# Altium schematic sheet PowerManagement_Base.SchDoc: Power Management Base
size A3; DrawnBy: Fabian Niederberger; Engineer: Fabian Niederberger; Organization: HSLU T&A; Address1: Abteilung Elektrotechnik; Address2: Technikumsstrasse 21; Address3: CH-6048 Horw; DocumentNumber: 1; Revision: 1.0; SheetNumber: 1; SheetTotal: 3; Projektname: PREN2 Team10; pcbDesigner: Fabian Niederberger; DocumentName: Power Managment Base; ProjectName: Power Managment Base
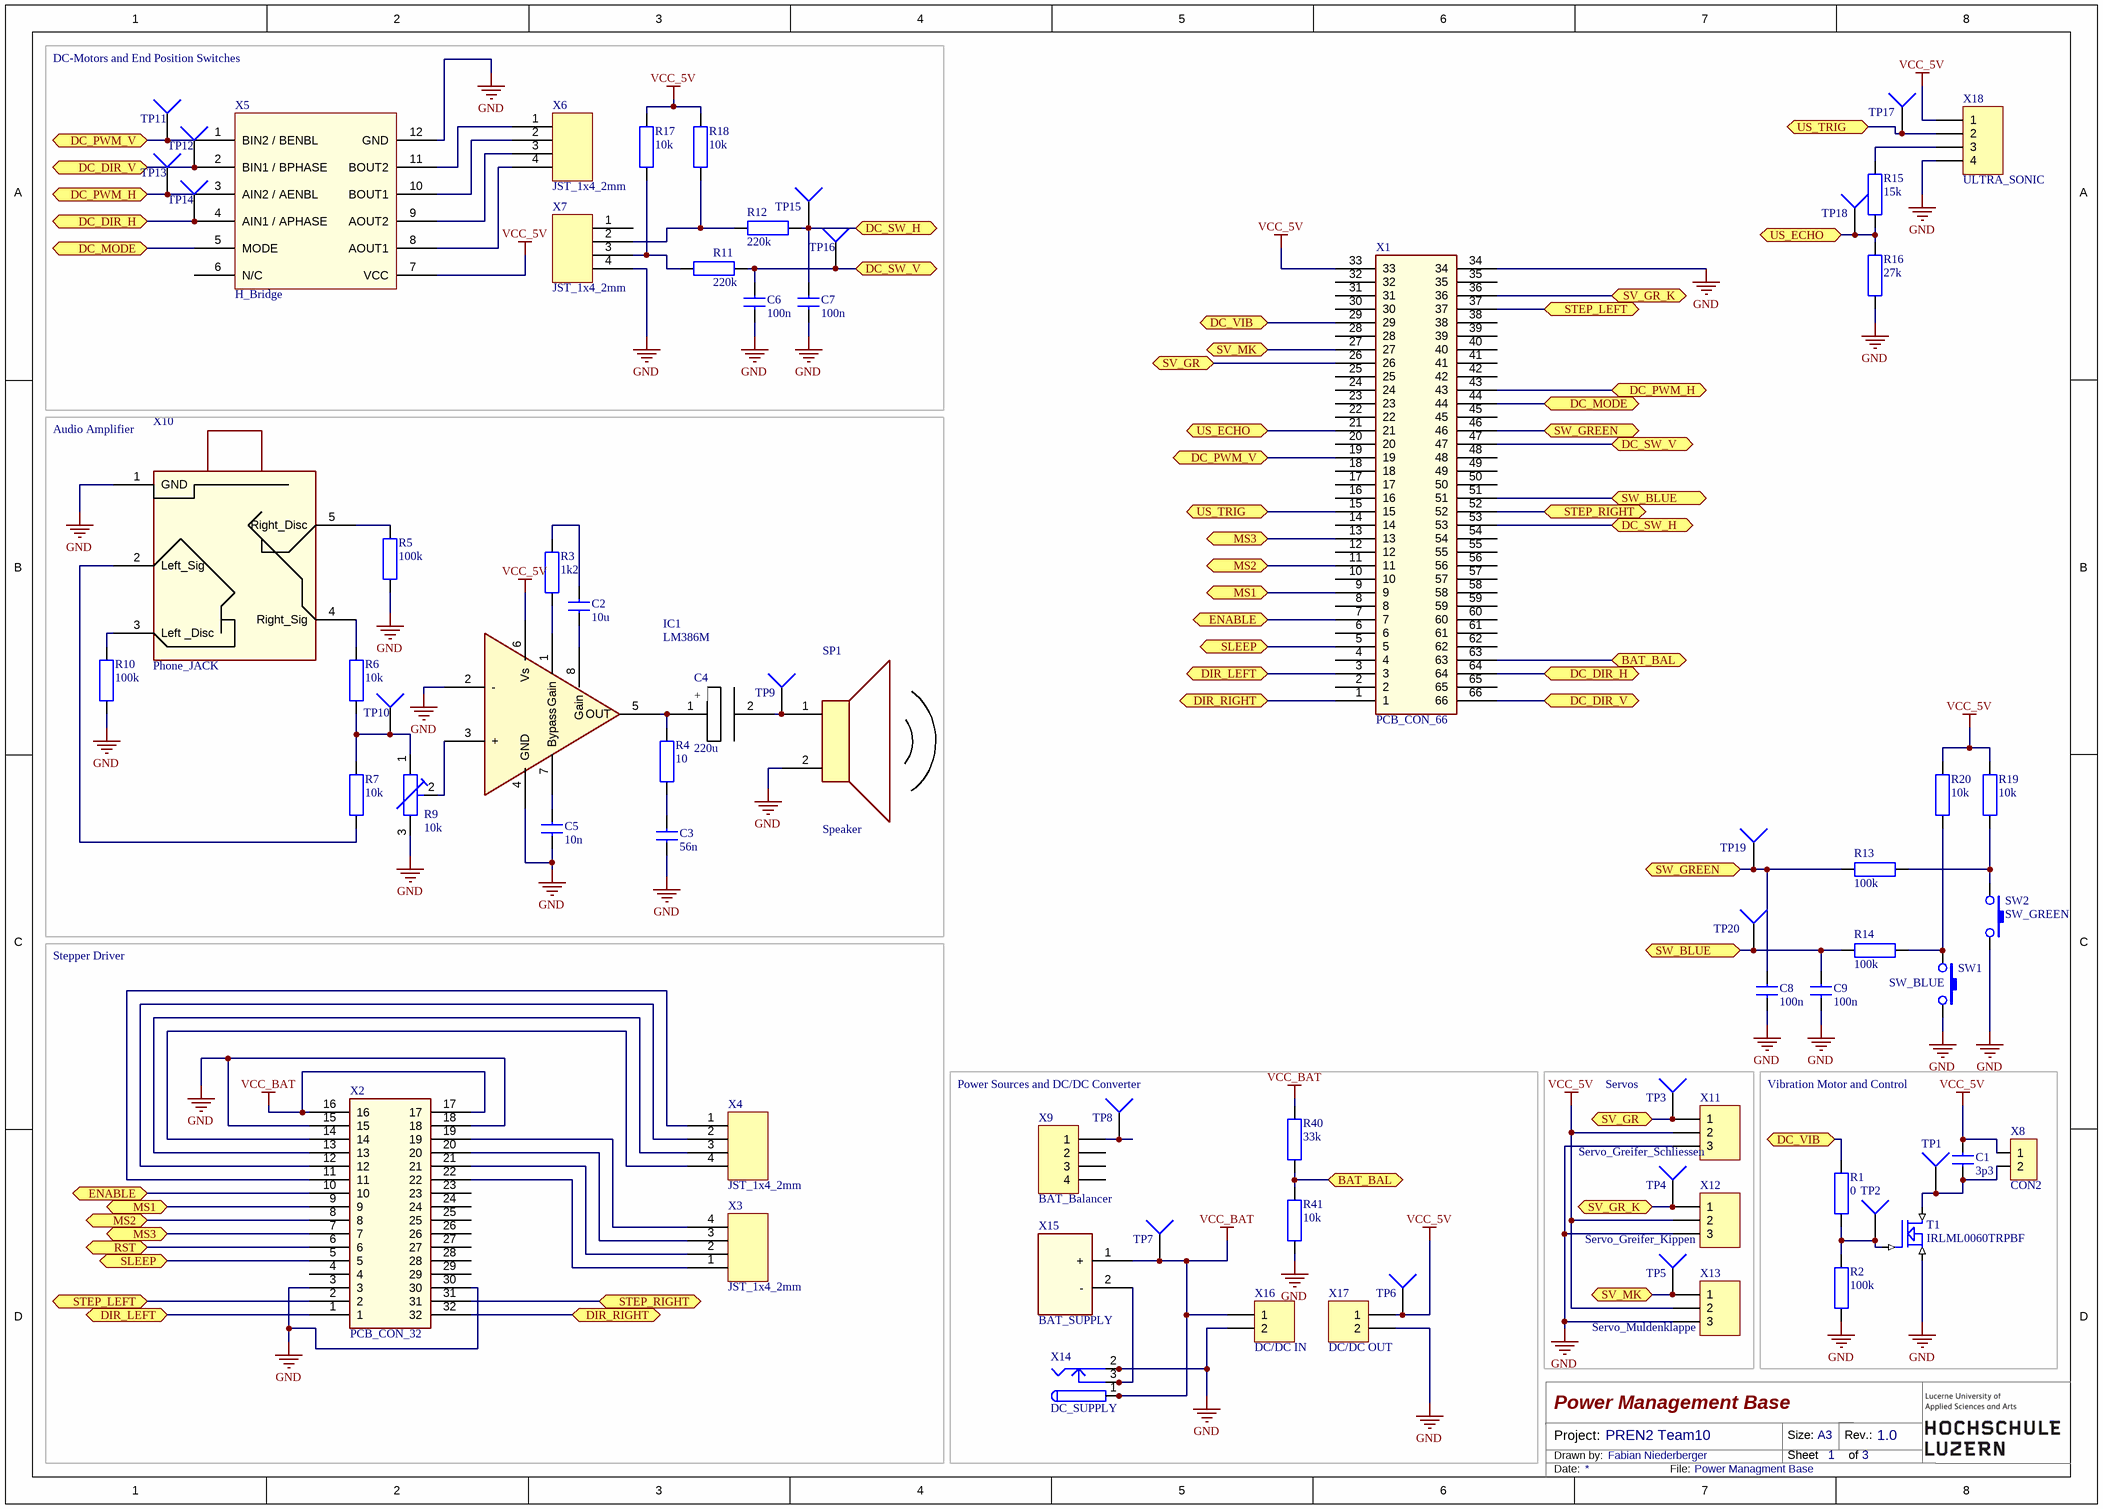
[diagram p0: PowerManagement_Base.SchDoc]

## Parts
C1  3p3  [0805]
C2  10u  [0805]
C3  56n  [0805]
C4  220u  [Elko]
C5  10n  [0805]
C6  100n  [0805]
C7  100n  [0805]
C8  100n  [0805]
C9  100n  [0805]
IC1  LM386M  [SO-8]
R1  0  [0805]
R2  100k  [0805]
R3  1k2  [0805]
R4  10  [0805]
R5  100k  [0805]
R6  10k  [0805]
R7  10k  [0805]
R9  10k  [POT2]
R10  100k  [0805]
R11  220k  [0805]
R12  220k  [0805]
R13  100k  [0805]
R14  100k  [0805]
R15  15k  [0805]
R16  27k  [0805]
R17  10k  [0805]
R18  10k  [0805]
R19  10k  [0805]
R20  10k  [0805]
R40  33k  [0805]
R41  10k  [0805]
SP1  Speaker  [Speaker]
SW1  SW_BLUE  [TASTER]
SW2  SW_GREEN  [TASTER]
T1  IRLML0060TRPBF  [SOT-23]
TP1  (no value)  [PIN1]
TP2  (no value)  [PIN1]
TP3  (no value)  [PIN1]
TP4  (no value)  [PIN1]
TP5  (no value)  [PIN1]
TP6  (no value)  [PIN1]
TP7  (no value)  [PIN1]
TP8  (no value)  [PIN1]
TP9  (no value)  [PIN1]
TP10  (no value)  [PIN1]
TP11  (no value)  [PIN1]
TP12  (no value)  [PIN1]
TP13  (no value)  [PIN1]
TP14  (no value)  [PIN1]
TP15  (no value)  [PIN1]
TP16  (no value)  [PIN1]
TP17  (no value)  [PIN1]
TP18  (no value)  [PIN1]
TP19  (no value)  [PIN1]
TP20  (no value)  [PIN1]
X1  PCB_CON_66  [PCB_CON_66_JACK]
X2  PCB_CON_32  [PCB_CON_32_JACK]
X3  JST_1x4_2mm  [JST_1x4_2mm_horizontal]
X4  JST_1x4_2mm  [JST_1x4_2mm_horizontal]
X5  H_Bridge  [H_Bridge]
X6  JST_1x4_2mm  [JST_1x4_2mm_horizontal]
X7  JST_1x4_2mm  [JST_1x4_2mm_horizontal]
X8  CON2  [HDR1X2]
X9  BAT_Balancer  [HDR1X4]
X10  Phone_JACK  [Audio_CON 3.5mm]
X11  Servo_Greifer_Schliessen  [HDR1X3]
X12  Servo_Greifer_Kippen  [HDR1X3]
X13  Servo_Muldenklappe  [HDR1X3]
X14  DC_SUPPLY  [KLD-0202]
X15  BAT_SUPPLY  [XT60_CON]
X16  DC/DC IN  [HDR1X2H]
X17  DC/DC OUT  [HDR1X2H]
X18  ULTRA_SONIC  [HDR1X4]

## Blocks framed on the sheet
DC-Motors and End Position Switches: C6 C7 R11 R12 R17 R18 TP11-TP16 X5-X7
Audio Amplifier: C2-C5 IC1 R3-R7 R9 R10 SP1 TP9 TP10 X10
Stepper Driver: X2-X4
Power Sources and DC/DC Converter: R40 R41 TP6-TP8 X9 X14-X17
Servos: TP3-TP5 X11-X13
Vibration Motor and Control: C1 R1 R2 T1 TP1 TP2 X8

## Ports
BAT_BAL, DC_DIR_H, DC_DIR_V, DC_MODE, DC_PWM_H, DC_PWM_V, DC_SW_H, DC_SW_V, DC_VIB, DIR_LEFT, DIR_RIGHT, ENABLE, MS1, MS2, MS3, RST, SLEEP, STEP_LEFT, STEP_RIGHT, SV_GR, SV_GR_K, SV_MK, SW_BLUE, SW_GREEN, US_ECHO, US_TRIG

## Nets
GND: C3.2 C5.2 C6.2 C7.2 C8.2 C9.2 IC1.2(-) IC1.4(GND) R2.1 R5.1 R9.3 R10.1 R16.1 R41.1 SP1.2 SW1.2 SW2.2 T1.SOURCE X1.34 X2.3 X2.15 X2.18 X2.30 X5.12(GND) X7.4 X10.1(GND) X11.3 X12.3 X13.3 X14.2 X14.2A X14.2B X16.2 X17.2 X18.4
VCC_5V: C1.2 IC1.6(Vs) R17.2 R18.2 R19.1 R20.2 TP6.1 X1.33 X5.7(VCC) X8.1 X11.2 X12.2 X13.2 X17.1 X18.1
VCC_BAT: R40.2 TP7.1 X2.16 X2.17 X14.1 X14.1A X14.1B X15.1(+) X16.1
BAT_BAL: R40.1 R41.2 X1.63 ; port BAT_BAL
DC_DIR_H: TP14.1 X1.64 X5.4(AIN1_/_APHASE) ; port DC_DIR_H
DC_DIR_V: TP12.1 X1.66 X5.2(BIN1_/_BPHASE) ; port DC_DIR_V
DC_MODE: X1.44 X5.5(MODE) ; port DC_MODE
DC_PWM_H: TP13.1 X1.43 X5.3(AIN2_/_AENBL) ; port DC_PWM_H
DC_PWM_V: TP11.1 X1.19 X5.1(BIN2_/_BENBL) ; port DC_PWM_V
DC_SW_H: C7.1 R12.2 TP15.1 X1.53 ; port DC_SW_H
DC_SW_V: C6.1 R11.2 TP16.1 X1.47 ; port DC_SW_V
DC_VIB: R1.2 X1.29 ; port DC_VIB
DIR_LEFT: X1.3 X2.1 ; port DIR_LEFT
DIR_RIGHT: X1.1 X2.32 ; port DIR_RIGHT
ENABLE: X1.7 X2.10 ; port ENABLE
MS1: X1.9 X2.9 ; port MS1
MS2: X1.11 X2.8 ; port MS2
MS3: X1.13 X2.7 ; port MS3
RST: X2.6 ; port RST
SLEEP: X1.5 X2.5 ; port SLEEP
STEP_LEFT: X1.37 X2.2 ; port STEP_LEFT
STEP_RIGHT: X1.52 X2.31 ; port STEP_RIGHT
SV_GR: TP3.1 X1.26 X11.1 ; port SV_GR
SV_GR_K: TP4.1 X1.36 X12.1 ; port SV_GR_K
SV_MK: TP5.1 X1.27 X13.1 ; port SV_MK
SW_BLUE: C9.1 R14.1 TP20.1 X1.51 ; port SW_BLUE
SW_GREEN: C8.1 R13.1 TP19.1 X1.46 ; port SW_GREEN
US_ECHO: R15.1 R16.2 TP18.1 X1.21 ; port US_ECHO
US_TRIG: TP17.1 X1.15 X18.2 ; port US_TRIG
NetC1_1: C1.1 T1.DRAIN TP1.1 X8.2
NetC2_1: C2.1 R3.2
NetC2_2: C2.2 IC1.8(Gain)
NetC3_1: C3.1 R4.1
NetC4_1: C4.1 IC1.5(OUT) R4.2
NetC4_2: C4.2 SP1.1 TP9.1
NetC5_1: C5.1 IC1.7(Bypass)
NetIC1_1: IC1.1(Gain) R3.1
NetIC1_3: IC1.3(+) R9.2
NetR1_1: R1.1 R2.2 T1.GATE TP2.1
NetR5_2: R5.2 X10.5(Right_Disc)
NetR6_1: R6.1 X10.4(Right_Sig)
NetR6_2: R6.2 R7.1 R9.1 TP10.1
NetR7_2: R7.2 X10.2(Left_Sig)
NetR10_2: R10.2 X10.3(Left__Disc)
NetR11_1: R11.1 R17.1 X7.3
NetR12_1: R12.1 R18.1 X7.2
NetR13_2: R13.2 R19.2 SW2.1
NetR14_2: R14.2 R20.1 SW1.1
NetR15_2: R15.2 X18.3
NetTP8_1: TP8.1 X9.1
NetX2_11: X2.11 X4.1
NetX2_12: X2.12 X4.2
NetX2_13: X2.13 X4.3
NetX2_14: X2.14 X4.4
NetX2_19: X2.19 X3.4
NetX2_20: X2.20 X3.3
NetX2_21: X2.21 X3.2
NetX2_22: X2.22 X3.1
NetX5_8: X5.8(AOUT1) X6.4
NetX5_9: X5.9(AOUT2) X6.3
NetX5_10: X5.10(BOUT1) X6.2
NetX5_11: X5.11(BOUT2) X6.1
NetX14_3: X14.3 X14.3A X14.3B X15.2(-)

Not connected (* = marked no-connect by the designer): X1 2 4 6 8 10 12 14 16 17 18 20 22 23 24 25 28 30 31 32 35 38 39 40 41 42 45 48 49 50 54 55 56 57 58 59 60 61 62 65; X2 4 23 24 25 26 27 28 29; X5 6(N/C); X7 1; X9 2 3 4

## Notes on the sheet
- Project:
- Drawn by:
- Size:
- Sheet
- A3
- Rev.:
- of
- Date:
- File:
- (in symbol Elko) +

## Library data of the parts
C1-C3 C5 = C?: Normaler Kondensator
C4 = Elko: Electrolyt Capacitor
C6 C8 C9 = C?: Normaler Kondensator; DC_Motor: DC_Motor_Switches_Debounce_C
C7 = C?: Normaler Kondensator; DC_Motor: DC_Motor_Swtiches_Debounce_C
IC1 = Audio Amp: Audio AMP in SO-8 Package
R1-R7 R10 R13-R16 R19 R20 R40 R41 = R?: Normaler Widerstand
R9 = R_POT1
R11 R12 R17 R18 = R?: Normaler Widerstand; DC_Motor: DC_Motor_Switch_Debounce
SP1 = Speaker: 8 Ohm Speaker
SW1 SW2 = SW-PB
T1 = MOSFET N
TP1-TP20 = Socket: LatestRevisionDate: 17-Jul-2002; LatestRevisionNote: Re-released for DXP Platform.; Publisher: Altium Limited
X1 = PCB_CON_66: Connects a PCB with another. This scheme is either jack or plug, depends on footprint
X2 = PCB_CON_32: Connects a PCB with another. This scheme is either jack or plug, depends on footprint
X3 X4 = JST_1x4_2mm: JST connector single row 4 pin, 2mm grid
X5 = H_Bridge: H-Bridge Shield
X6 = JST_1x4_2mm: JST connector single row 4 pin, 2mm grid; DC_Motor: DC_Motor_CON
X7 = JST_1x4_2mm: JST connector single row 4 pin, 2mm grid; DC_Motor: DC_Motor_Switches
X9 X18 = Header 4: Header, 4-Pin; LatestRevisionDate: 17-Jul-2002; LatestRevisionNote: Re-released for DXP Platform.; Publisher: Altium Limited
X10 = Phone_JACK: 3.5 mm Phone Jack Stereo with Disconnect information
X11-X13 = Header 3: Header, 3-Pin; LatestRevisionDate: 17-Jul-2002; LatestRevisionNote: Re-released for DXP Platform.; Publisher: Altium Limited
X14 = PWR2.5: Low Voltage Power Supply Connector; Published: 17-Dec-2003; DatasheetDocument: 09-May-2002; Publisher: Altium Limited; ComponentLink1Description: Manufacturer Link; ComponentLink1URL: http://domino.kycon.com/internet/Products.html
X15 = XT60_CON: XT60 LiPo Accumulator Connector
X16 X17 = Header 2H: Header, 2-Pin, Right Angle; LatestRevisionDate: 17-Jul-2002; LatestRevisionNote: Re-released for DXP Platform.; Publisher: Altium Limited